# EAGLE design draft1 (EAGLE 9.6.0)
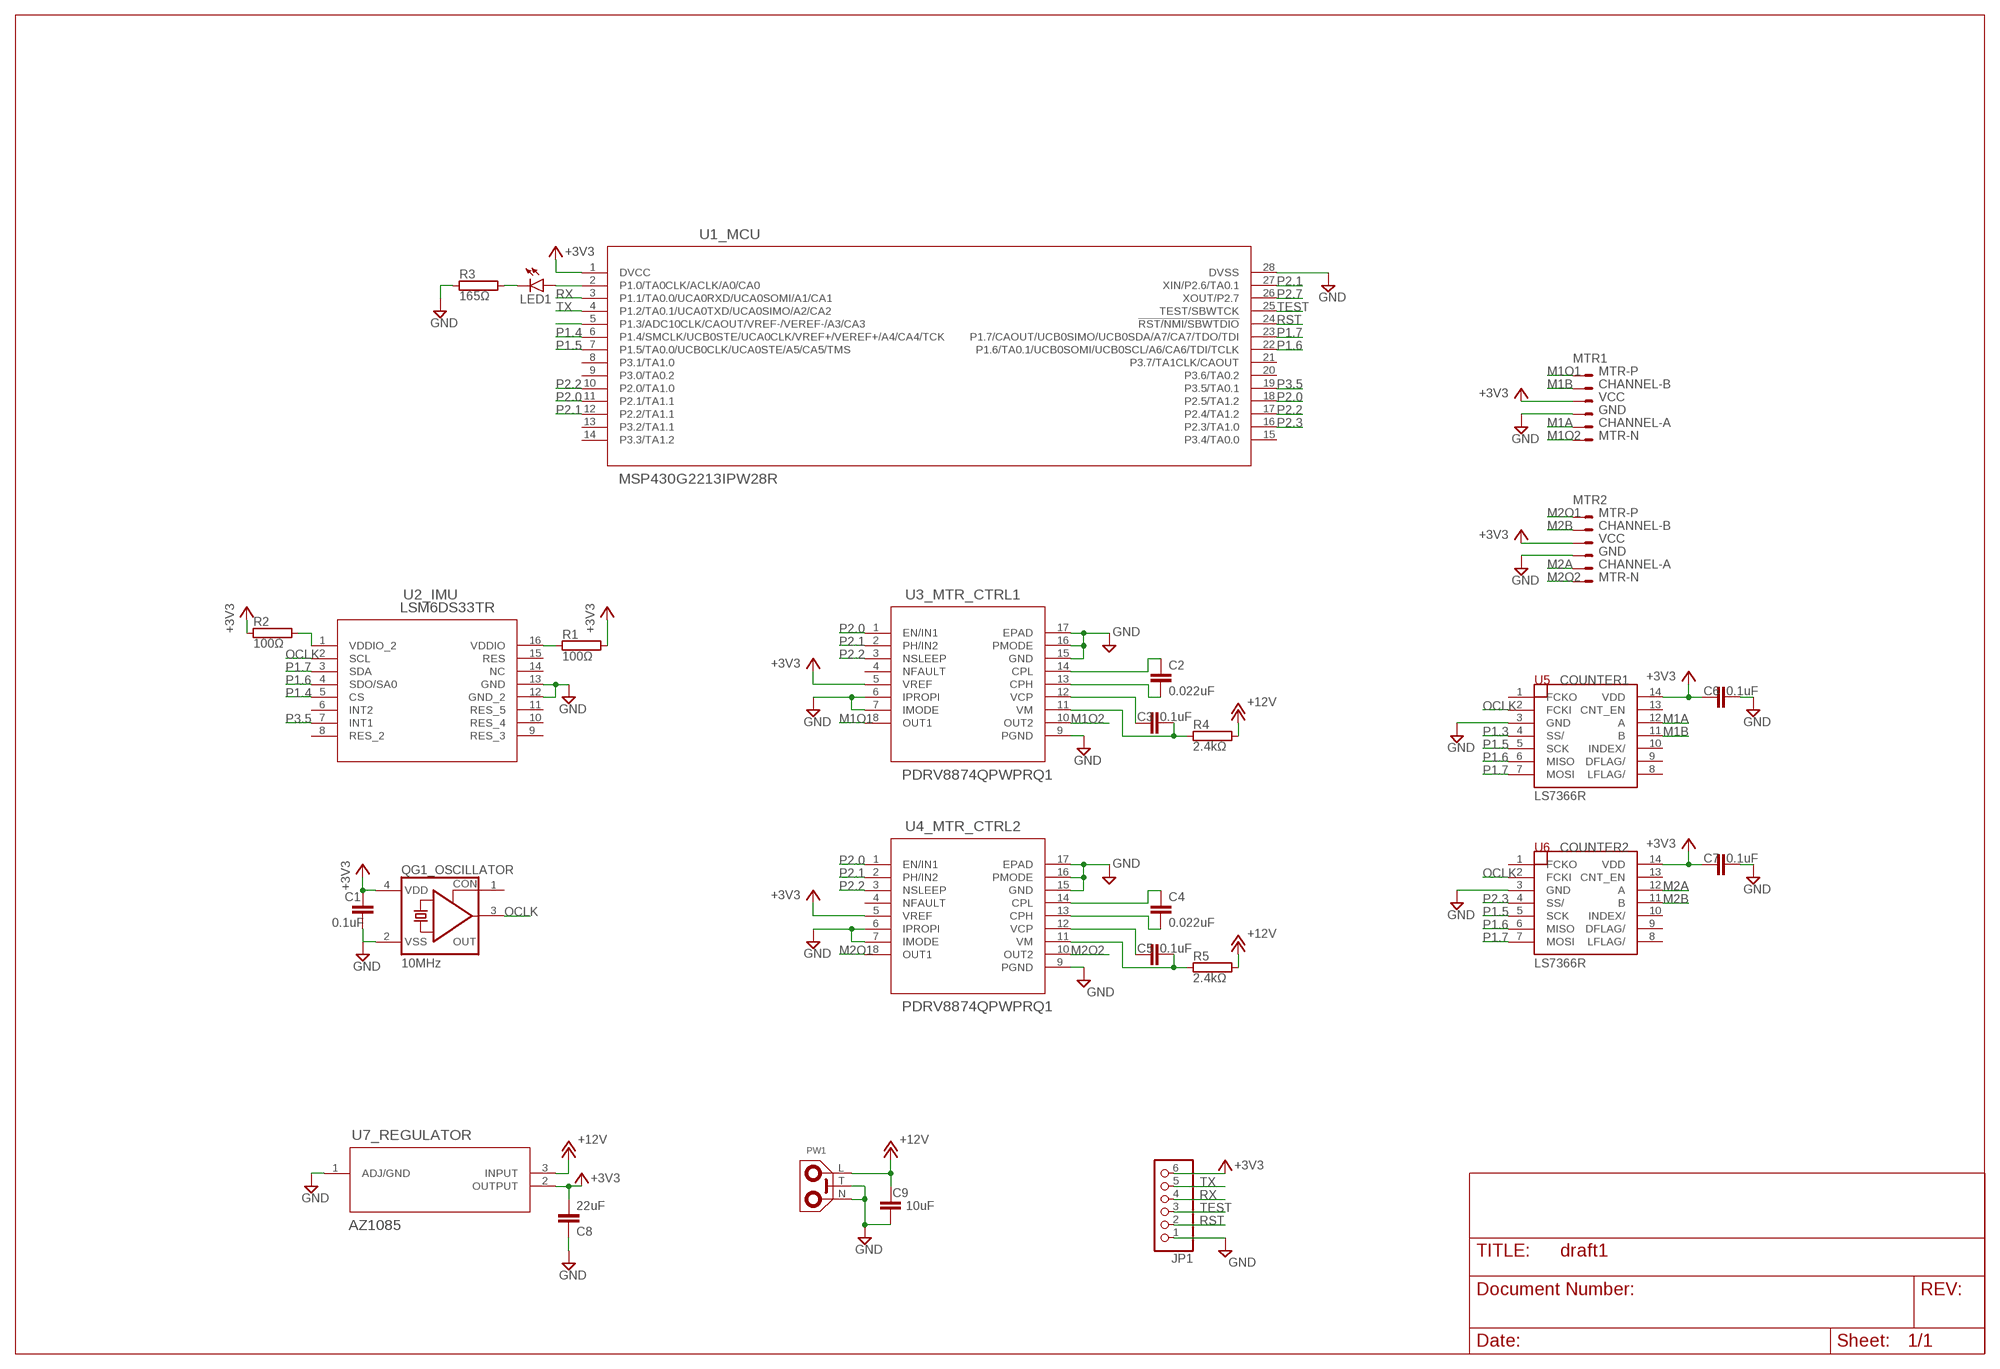
[diagram p0: schematic, sheet 1]

## Parts
C1  0.1uF  C2.5/2  [C2.5-2]
C2  0.022uF  C2.5/2  [C2.5-2]
C3  0.1uF  C2.5/2  [C2.5-2]
C4  0.022uF  C2.5/2  [C2.5-2]
C5  0.1uF  C2.5/2  [C2.5-2]
C6  0.1uF  C2.5/2  [C2.5-2]
C7  0.1uF  C2.5/2  [C2.5-2]
C8  22uF  C2.5/2  [C2.5-2]
C9  10uF  C2.5/2  [C2.5-2]
JP1  PINHD-1X6  [1X06]
LED1  LED5MM  [LED5MM]
MTR1  JST-XH-06-PIN-ROUND-PAD  [JST-XH-06-PACKAGE-ROUND-PAD]
MTR2  JST-XH-06-PIN-ROUND-PAD  [JST-XH-06-PACKAGE-ROUND-PAD]
PW1  POWER-PM  [POWER-PM]
QG1_OSCILLATOR  10MHz  CRYSTAL_RES-1100S  [1100S]
R1  100Ω  RAC01  [AC01]
R2  100Ω  RAC01  [AC01]
R3  165Ω  RAC01  [AC01]
R4  2.4kΩ  RAC01  [AC01]
R5  2.4kΩ  RAC01  [AC01]
U1_MCU  MSP430G2213IPW28R  [PW28]
U2_IMU  LSM6DS33TR  [LGA-16L_3X3]
U3_MTR_CTRL1  PDRV8874QPWPRQ1  [PWP16]
U4_MTR_CTRL2  PDRV8874QPWPRQ1  [PWP16]
U5  LS7366R  [SO14]
U6  LS7366R  [SO14]
U7_REGULATOR  AZ1085  [TO-263_DIO]

## Nets
+3V3: C1.1 C6.1 C7.1 C8.2 JP1.6 MTR1.3 MTR2.3 QG1_OSCILLATOR.4(VDD) R1.2 R2.1 U1_MCU.1(DVCC) U3_MTR_CTRL1.5(VREF) U4_MTR_CTRL2.5(VREF) U5.14(VDD) U6.14(VDD) U7_REGULATOR.2(OUTPUT)
+12V: C9.1 PW1.L R4.2 R5.2 U7_REGULATOR.3(INPUT)
GND: C1.2 C6.2 C7.2 C8.1 C9.2 JP1.1 MTR1.4 MTR2.4 PW1.N PW1.T QG1_OSCILLATOR.2(VSS) R3.1 U1_MCU.28(DVSS) U2_IMU.12(GND_2) U2_IMU.13(GND) U3_MTR_CTRL1.6(IPROPI) U3_MTR_CTRL1.7(IMODE) U3_MTR_CTRL1.9(PGND) U3_MTR_CTRL1.15(GND) U3_MTR_CTRL1.16(PMODE) U3_MTR_CTRL1.17(EPAD) U4_MTR_CTRL2.6(IPROPI) U4_MTR_CTRL2.7(IMODE) U4_MTR_CTRL2.9(PGND) U4_MTR_CTRL2.15(GND) U4_MTR_CTRL2.16(PMODE) U4_MTR_CTRL2.17(EPAD) U5.3(GND) U6.3(GND) U7_REGULATOR.1(ADJ/GND)
M1A: MTR1.5 U5.12(A)
M1B: MTR1.2 U5.11(B)
M1O1: MTR1.1 U3_MTR_CTRL1.8(OUT1)
M1O2: MTR1.6 U3_MTR_CTRL1.10(OUT2)
M2A: MTR2.5 U6.12(A)
M2B: MTR2.2 U6.11(B)
M2O1: MTR2.1 U4_MTR_CTRL2.8(OUT1)
M2O2: MTR2.6 U4_MTR_CTRL2.10(OUT2)
N$1: LED1.A U1_MCU.2(P1.0/TA0CLK/ACLK/A0/CA0)
N$2: R2.2 U2_IMU.1(VDDIO_2)
N$3: R1.1 U2_IMU.16(VDDIO)
N$4: LED1.K(C) R3.2
N$5: U1_MCU.5(P1.3/ADC10CLK/CAOUT/VREF-/VEREF-/A3/CA3)
N$6: C2.1 U3_MTR_CTRL1.14(CPL)
N$7: C2.2 U3_MTR_CTRL1.13(CPH)
N$8: C3.1 U3_MTR_CTRL1.12(VCP)
N$9: C4.1 U4_MTR_CTRL2.14(CPL)
N$10: C3.2 R4.1 U3_MTR_CTRL1.11(VM)
N$12: C4.2 U4_MTR_CTRL2.13(CPH)
N$13: C5.1 U4_MTR_CTRL2.12(VCP)
N$14: C5.2 R5.1 U4_MTR_CTRL2.11(VM)
OCLK: QG1_OSCILLATOR.3(OUT) U2_IMU.2(SCL) U5.2(FCKI) U6.2(FCKI)
P1.3: U5.4(SS/)
P1.4: U1_MCU.6(P1.4/SMCLK/UCB0STE/UCA0CLK/VREF+/VEREF+/A4/CA4/TCK) U2_IMU.5(CS)
P1.5: U1_MCU.7(P1.5/TA0.0/UCB0CLK/UCA0STE/A5/CA5/TMS) U5.5(SCK) U6.5(SCK)
P1.6: U1_MCU.22(P1.6/TA0.1/UCB0SOMI/UCB0SCL/A6/CA6/TDI/TCLK) U2_IMU.4(SDO/SA0) U5.6(MISO) U6.6(MISO)
P1.7: U1_MCU.23(P1.7/CAOUT/UCB0SIMO/UCB0SDA/A7/CA7/TDO/TDI) U2_IMU.3(SDA) U5.7(MOSI) U6.7(MOSI)
P2.0: U1_MCU.11(P2.1/TA1.1) U1_MCU.18(P2.5/TA1.2) U3_MTR_CTRL1.1(EN/IN1) U4_MTR_CTRL2.1(EN/IN1)
P2.1: U1_MCU.12(P2.2/TA1.1) U1_MCU.27(XIN/P2.6/TA0.1) U3_MTR_CTRL1.2(PH/IN2) U4_MTR_CTRL2.2(PH/IN2)
P2.2: U1_MCU.10(P2.0/TA1.0) U1_MCU.17(P2.4/TA1.2) U3_MTR_CTRL1.3(NSLEEP) U4_MTR_CTRL2.3(NSLEEP)
P2.3: U1_MCU.16(P2.3/TA1.0) U6.4(SS/)
P2.7: U1_MCU.26(XOUT/P2.7)
P3.5: U1_MCU.19(P3.5/TA0.1) U2_IMU.7(INT1)
RST: JP1.2 U1_MCU.24(!RST/NMI/SBWTDIO)
RX: JP1.4 U1_MCU.3(P1.1/TA0.0/UCA0RXD/UCA0SOMI/A1/CA1)
TEST: JP1.3 U1_MCU.25(TEST/SBWTCK)
TX: JP1.5 U1_MCU.4(P1.2/TA0.1/UCA0TXD/UCA0SIMO/A2/CA2)
Unconnected: QG1_OSCILLATOR.1(CON) U1_MCU.8(P3.1/TA1.0) U1_MCU.9(P3.0/TA0.2) U1_MCU.13(P3.2/TA1.1) U1_MCU.14(P3.3/TA1.2) U1_MCU.15(P3.4/TA0.0) U1_MCU.20(P3.6/TA0.2) U1_MCU.21(P3.7/TA1CLK/CAOUT) U2_IMU.6(INT2) U2_IMU.8(RES_2) U2_IMU.9(RES_3) U2_IMU.10(RES_4) U2_IMU.11(RES_5) U2_IMU.14(NC) U2_IMU.15(RES) U3_MTR_CTRL1.4(NFAULT) U4_MTR_CTRL2.4(NFAULT) U5.1(FCKO) U5.8(LFLAG/) U5.9(DFLAG/) U5.10(INDEX/) U5.13(CNT_EN) U6.1(FCKO) U6.8(LFLAG/) U6.9(DFLAG/) U6.10(INDEX/) U6.13(CNT_EN)

## Library data of the parts
C1-C9 = capacitor-wima:C: CAPACITOR naming: grid - package width
JP1 = pinhead:PINHD-1X6: PIN HEADER
LED1 = led:LED: LED OSRAM: - CHIPLED LG R971, LG N971, LY N971, LG Q971, LY Q971, LO R971, LY R971 LH N974, LH R974 LS Q976, LO Q976, LY Q976 LO Q996 - Hyper CHIPLED LW Q18S LB Q993, LB Q99A, LB R99A - SideLED LS A670, LO A670, LY A670, LG A670, LP A670 LB A673, LV A673, LT A673, LW A673 LH A674 LY A675 LS A676, LA A676, LO A676, LY A676, LW A676 LS A679, LY A679, LG A679 - Hyper Micro SIDELED® LS Y876, LA Y876, LO Y876, LY Y876 LT Y87S - SmartLED LW L88C, LW L88S LB L89C, LB L89S, LG L890 LS L89K, LO L89K, LY L89K LS L896, LA L896, LO L896, LY L896 - TOPLED LS T670, LO T670, LY T670, LG T670, LP T670 LSG T670, LSP T670, LSY T670, LOP T670, LYG T670 LG T671, LOG T671, LSG T671 LB T673, LV T673, LT T673, LW T673 LH T674 LS T676, LA T676, LO T676, LY T676, LB T676, LH T676, LSB T676, LW T676 LB T67C, LV T67C, LT T67C, LS T67K, LO T67K, LY T67K, LW E67C LS E67B, LA E67B, LO E67B, LY E67B, LB E67C, LV E67C, LT E67C LW T67C LS T679, LY T679, LG T679 LS T770, LO T770, LY T770, LG T770, LP T770 LB T773, LV T773, LT T773, LW T773 LH T774 LS E675, LA E675, LY E675, LS T675 LS T776, LA T776, LO T776, LY T776, LB T776 LHGB T686 LT T68C, LB T68C - Hyper Mini TOPLED® LB M676 - Mini TOPLED Santana® LG M470 LS M47K, LO M47K, LY M47K Source: http://www.osram.convergy.de LUXEON: - LUMILED® LXK2-PW12-R00, LXK2-PW12-S00, LXK2-PW14-U00, LXK2-PW14-V00 LXK2-PM12-R00, LXK2-PM12-S00, LXK2-PM14-U00 LXK2-PE12-Q00, LXK2-PE12-R00, LXK2-PE12-S00, LXK2-PE14-T00, LXK2-PE14-U00 LXK2-PB12-K00, LXK2-PB12-L00, LXK2-PB12-M00, LXK2-PB14-N00, LXK2-PB14-P00, LXK2-PB14-Q00 LXK2-PR12-L00, LXK2-PR12-M00, LXK2-PR14-Q00, LXK2-PR14-R00 LXK2-PD12-Q00, LXK2-PD12-R00, LXK2-PD12-S00 LXK2-PH12-R00, LXK2-PH12-S00 LXK2-PL12-P00, LXK2-PL12-Q00, LXK2-PL12-R00 Source: www.luxeon.com KINGBRIGHT: KA-3528ASYC Source: www.kingbright.com
MTR1 MTR2 = JST:JST-XH-06-PIN: JST XH Connector 2 Pin Wire to board connector. Pitch: 2,54 mm, (0.100") Number of pins: 6 Created by Rembrandt Electronics www.rembrandtelectronics.com; MTR1: 1
PW1 = Power-in:POWER-PM
QG1_OSCILLATOR = SE423EagleLibrary:CRYSTAL_RES-: CRYSTAL RESONATOR; OC_FARNELL: unknown; OC_NEWARK: unknown
R1-R5 = resistor-power:R: Power Resitor; OC_FARNELL: unknown; OC_NEWARK: unknown
U1_MCU = SE423EagleLibrary:MSP430G2213IPW28R; BUILT_BY: EMA_UL_Team; MANUFACTURER: Texas Instruments; MANUFACTURER_PART_NUMBER: MSP430G2213IPW28R; VENDOR: Texas Instruments
U2_IMU = SE423EagleLibrary:LSM6DS33TR; BUILT_BY: EMA_Jessica; COPYRIGHT: Copyright (C) 2018 Accelerated Designs. All rights reserved; MANUFACTURER_PART_NUMBER: LSM6DS33TR; VENDOR: STMicroelectronics
U3_MTR_CTRL1 U4_MTR_CTRL2 = SE423EagleLibrary:PDRV8874QPWPRQ1; COPYRIGHT: Copyright (C) 2018 Accelerated Designs. All rights reserved; MANUFACTURER_PART_NUMBER: PDRV8874QPWPRQ1; VENDOR: Texas Instruments
U5 U6 = SE423EagleLibrary:LS7366R
U7_REGULATOR = Power-in:AZ1085; BUILT_BY: EMA_UL_Team; MANUFACTURER_PART_NUMBER: AZ1085CS-2.5TRE1; SOURCELIBRARY: DIODESINC_2_2015-08-18; VENDOR: Diodes Inc

## Board
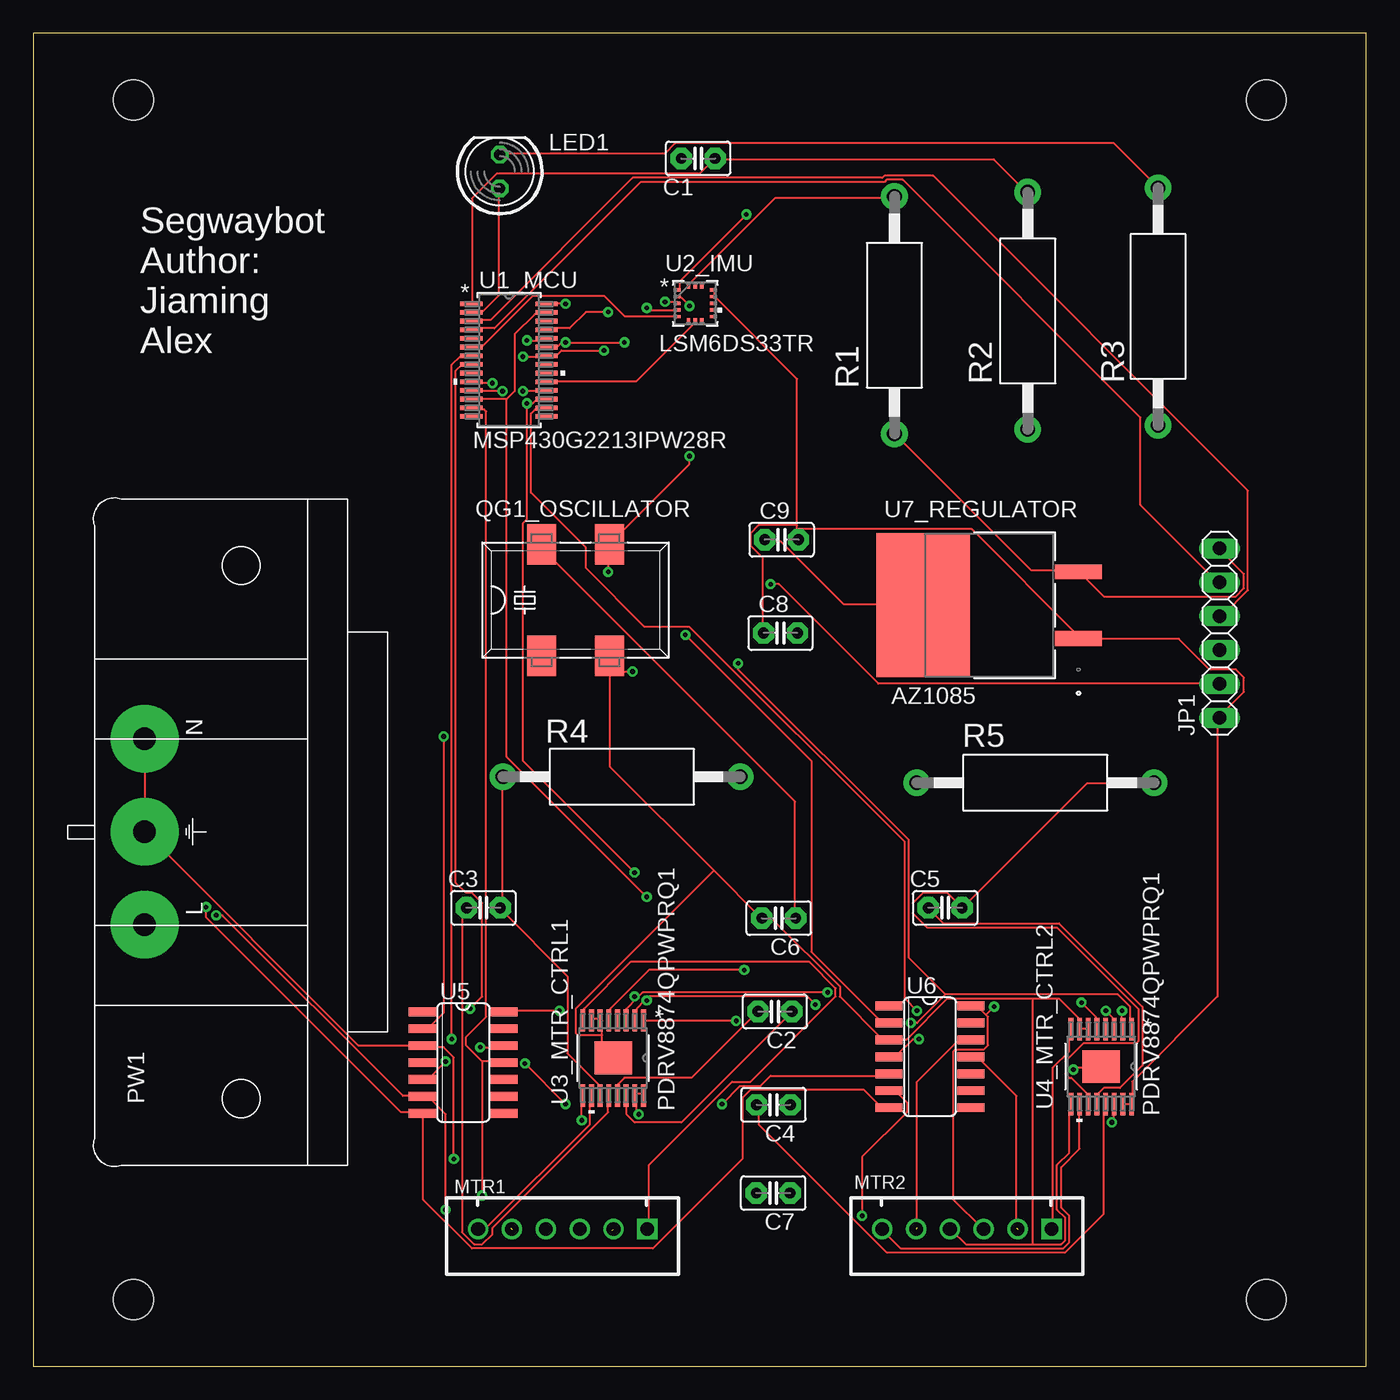
[diagram p1: board, top side]
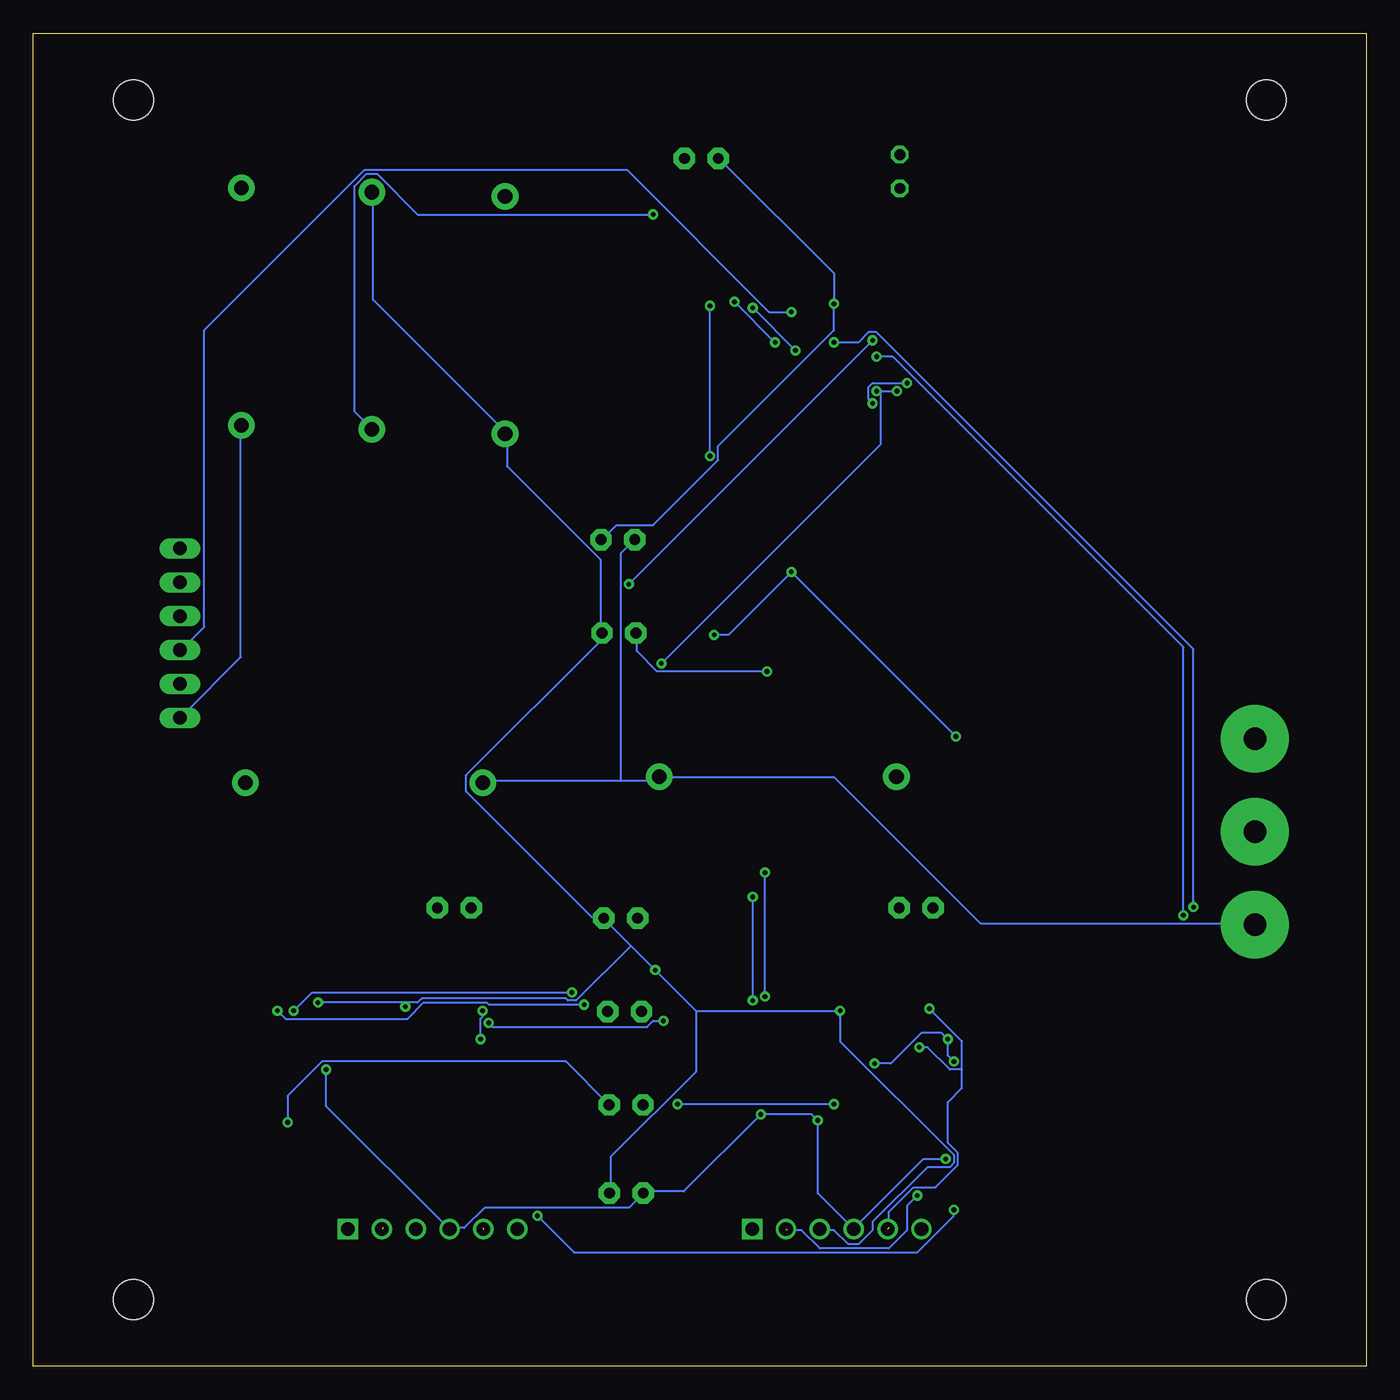
[diagram p2: board, bottom side, seen from below]

Size 100 x 100 mm. Coordinates in mm from the lower left corner, seen from the top.
Outline: 0,0 100,0 100,100 0,100 0,0
Copper layers (1*16): Top 0.035mm / dielectric 1.5mm / Bottom 0.035mm
Design rules "default": minimum track width 6mil, minimum drill 0.35mm, track to track 6mil, track to pad 6mil, pad to pad 6mil, via to via 6mil, smd to smd 6mil, copper to edge 40mil, drill to drill 6mil, minimum pad ring 10mil, minimum via ring 8mil, stop-mask expansion 4mil, vias tented up to drill 0mil, thermal gap 10mil
Holes 3 mm at 7.5,5 7.5,95 92.5,95 92.5,5

### Footprints (pad centres in the part's own frame; a part is rotated, then mirrored left to right if it is on the bottom)
C2.5-2 = drill 0.813 pad 1.6 octagon: 1 -1.27,0; 2 1.27,0
1X06 = drill 1.016 long: 1 -6.35,0; 2 -3.81,0; 3 -1.27,0; 4 1.27,0; 5 3.81,0; 6 6.35,0
LED5MM = drill 0.813 octagon: A -1.27,0; K 1.27,0
JST-XH-06-PACKAGE-ROUND-PAD = drill 1.016 square: 1 -6.35,0 | drill 1.016: 2 -3.81,0; 3 -1.27,0; 4 1.27,0; 5 3.81,0; 6 6.35,0
POWER-PM = drill 1.676 pad 5.08: L 6.985,-6.35; N -6.985,-6.35; T 0,-6.35
1100S = smd 2.184 x 3.048: 1 -2.54,-4.191; 2 2.54,-4.191; 3 2.54,4.191; 4 -2.54,4.191
AC01 = drill 1.1 pad 2: 1 -8.9,0; 2 8.9,0
PW28 = smd 1.676 x 0.356: 1 -2.819,4.225; 2 -2.819,3.575; 3 -2.819,2.925; 4 -2.819,2.275; 5 -2.819,1.625; 6 -2.819,0.975; 7 -2.819,0.325; 8 -2.819,-0.325; 9 -2.819,-0.975; 10 -2.819,-1.625; 11 -2.819,-2.275; 12 -2.819,-2.925; 13 -2.819,-3.575; 14 -2.819,-4.225; 15 2.819,-4.225; 16 2.819,-3.575; 17 2.819,-2.925; 18 2.819,-2.275; 19 2.819,-1.625; 20 2.819,-0.975; 21 2.819,-0.325; 22 2.819,0.325; 23 2.819,0.975; 24 2.819,1.625; 25 2.819,2.275; 26 2.819,2.925; 27 2.819,3.575; 28 2.819,4.225
LGA-16L_3X3 = smd 0.356 x 0.254: 1 -1.27,1; 2 -1.27,0.5; 3 -1.27,0; 4 -1.27,-0.5; 5 -1.27,-1; 9 1.27,-1; 10 1.27,-0.5; 11 1.27,0; 12 1.27,0.5; 13 1.27,1 | smd 0.254 x 0.356: 6 -0.5,-1.27; 7 0,-1.27; 8 0.5,-1.27; 14 0.5,1.27; 15 0,1.27; 16 -0.5,1.27
PWP16 = smd 1.676 x 0.356: 1 -2.819,2.275; 2 -2.819,1.625; 3 -2.819,0.975; 4 -2.819,0.325; 5 -2.819,-0.325; 6 -2.819,-0.975; 7 -2.819,-1.625; 8 -2.819,-2.275; 9 2.819,-2.275; 10 2.819,-1.625; 11 2.819,-0.975; 12 2.819,-0.325; 13 2.819,0.325; 14 2.819,0.975; 15 2.819,1.625; 16 2.819,2.275 | smd 2.464 x 2.819: 17 0,0
SO14 = smd 0.66 x 2.032: 1 -3.81,-3.073; 2 -2.54,-3.073; 3 -1.27,-3.073; 4 0,-3.073; 5 1.27,-3.073; 6 2.54,-3.073; 7 3.81,-3.073; 8 3.81,3.073; 9 2.54,3.073; 10 1.27,3.073; 11 0,3.073; 12 -1.27,3.073; 13 -2.54,3.073; 14 -3.81,3.073
TO-263_DIO = smd 1.1 x 3.5: 1 -2.5,-6.7; 2 2.5,-6.7 | smd 10.8 x 7.01: 3 0,4.945

### Placement (x,y rotation side)
C1  49.88,90.61 180 top
C2  55.64,26.61 180 top
C3  33.77,34.39 0 top
C4  55.53,19.61 180 top
C5  68.42,34.39 0 top
C6  55.93,33.61 180 top
C7  55.51,12.99 180 top
C8  56.06,55.01 0 top
C9  56.14,62.01 0 top
JP1  89,55 90 top
LED1  34.99,89.63 90 top
MTR1  39.72,10.28 180 top
MTR2  70.04,10.28 180 top
PW1  14.7,40.1 270 top
QG1_OSCILLATOR  40.68,57.48 0 top
R1  64.61,78.86 270 top
R2  74.61,79.18 270 top
R3  84.39,79.5 90 top
R4  44.14,44.23 0 top
R5  75.18,43.77 180 top
U1_MCU  35.69,75.48 0 top
U2_IMU  49.66,79.74 0 top
U3_MTR_CTRL1  43.5,23.12 270 top
U4_MTR_CTRL2  80.12,22.48 270 top
U5  32.26,22.78 270 top
U6  67.26,23.21 270 top
U7_REGULATOR  71.71,57.09 90 top

### Tracks (layer width: path | path; a pad name or v marks a point on that pad's centre or on a via)
+3V3  (via drill 0.35)
  Top 0.152: U1_MCU.1 32.92,79.7 32.92,87.63 34.75,89.46 49.99,89.46 51.05,90.53 C1.1 51.21,90.53 72.08,90.53 74.52,88.09 R2.1 | JP1.6 89,61.27 90.83,59.44 90.83,58.37 90.22,57.76 80.31,57.76 78.49,59.59 U7_REGULATOR.2 78.33,59.74 74.83,59.74 R1.2 | 71.48,26.36 71.63,26.21 71.63,24.08 71.32,23.77 69.19,23.77 69.04,23.62 69.04,12.5 71.17,10.36 MTR2.3 | 71.48,26.36 70.87,26.98 70.41,26.98 U6.14 | v53.34,29.72 46.18,29.72 43.28,26.82 43.28,26.06 U3_MTR_CTRL1.5 | v78.64,27.28 79.7,26.21 79.7,25.45 U4_MTR_CTRL2.5 | v39.47,26.67 35.36,26.67 U5.14 | QG1_OSCILLATOR.4 38.25,61.57 38.25,61.27 57.15,42.37 57.15,33.68 C6.1 | v72.08,26.98 71.48,26.36
  Bottom 0.152: R2.1 74.52,87.94 74.52,80.01 64.62,70.1 R1.2 64.47,69.95 64.47,67.51 57.45,60.5 57.45,55.02 C8.2 57.45,54.86 57.45,54.41 67.51,44.35 67.51,43.13 58.06,33.68 57.3,33.68 C6.1 57.15,33.53 55.17,31.55 | 55.17,31.55 v53.34,29.72 50.29,26.67 | 72.08,27.28 71.17,27.28 70.87,27.58 60.05,27.58 59.89,27.43 59.28,27.43 55.17,31.55 | 72.08,27.28 v78.64,27.28 | 50.29,26.67 v39.47,26.67 39.47,24.38 30.94,15.85 30.94,15.24 31.24,14.94 32.92,14.94 37.03,10.82 37.03,10.21 38.1,9.14 38.86,9.14 39.93,10.21 40.84,10.21 MTR1.3 | 50.29,26.67 50.29,22.1 56.69,15.7 56.69,13.11 C7.1 | 72.08,27.28 v72.08,26.98
+12V
  Top 0.152: C9.1 55.02,61.87 56.08,61.87 60.81,57.15 66.75,57.15 U7_REGULATOR.3
  Bottom 0.152: 55.93,43.89 53.49,43.89 53.19,44.2 R4.2 53.03,44.2 39.93,44.2 28.96,33.22 8.38,33.22 PW1.L | 55.93,43.89 66.14,43.89 R5.2 | 55.93,43.89 55.93,60.96 55.02,61.87 C9.1
GND  (via drill 0.35)
  Top 0.152: v39.93,79.7 38.56,79.7 U1_MCU.28 | U2_IMU.13 51.05,80.62 51.05,80.31 U2_IMU.12 51.05,80.16 51.21,80.16 57.3,74.07 57.3,63.09 | 57.3,62.79 57.3,62.03 C9.2 57.3,62.79 | 57.3,62.79 57.3,63.09 | 57.3,63.09 54.41,63.09 53.8,62.48 53.8,61.57 54.71,60.66 54.71,55.02 C8.1 | U4_MTR_CTRL2.15 81.84,19.66 82.3,19.66 U4_MTR_CTRL2.16 82.45,19.81 82.45,21.34 88.85,27.74 88.85,48.62 JP1.1 89,48.77 90.83,50.6 90.83,51.66 90.22,52.27 88.24,52.27 85.95,54.56 78.49,54.56 U7_REGULATOR.1 78.49,54.71 70.41,62.79 57.3,62.79 | U4_MTR_CTRL2.6 79.1,25.3 78.64,25.3 U4_MTR_CTRL2.7 78.49,25.45 78.49,26.06 76.96,27.58 74.98,27.58 | 74.98,27.58 68.58,27.58 65.53,24.54 64.31,24.54 U6.3 64.16,24.54 63.7,24.54 60.5,27.74 60.5,28.5 55.47,33.53 54.71,33.53 C6.2 54.56,33.68 51.05,37.19 | U3_MTR_CTRL1.7 41.91,26.06 42.52,26.06 U3_MTR_CTRL1.6 42.67,25.91 42.67,24.84 | 42.67,24.84 42.67,23.93 43.43,23.16 U3_MTR_CTRL1.17 | 43.28,52.12 43.28,44.96 51.05,37.19 | 43.28,52.12 43.28,53.19 QG1_OSCILLATOR.2 43.28,52.12 | 42.67,24.84 40.84,24.84 40.69,24.99 40.69,26.82 51.05,37.19 | PW1.N 8.38,46.94 8.38,40.23 PW1.T 8.38,40.08 24.38,24.08 29.11,24.08 U5.3 29.26,23.93 30.79,23.93 31.55,23.16 v31.55,15.54 | 74.98,9.14 69.95,9.14 68.89,10.21 MTR2.4 | 74.98,9.14 77.11,9.14 77.42,9.45 77.42,11.12 76.81,11.73 76.81,15.09 77.72,16 77.72,19.66 U4_MTR_CTRL2.9 | v78.03,22.25 78.18,22.4 80.01,22.4 U4_MTR_CTRL2.17 | U3_MTR_CTRL1.16 45.72,20.42 45.26,20.42 U3_MTR_CTRL1.15 45.26,20.27 45.26,19.05 v45.41,18.9 | v41.15,18.44 41.15,20.27 U3_MTR_CTRL1.9 | 74.98,9.14 74.98,27.58 | 43.28,52.12 v44.96,52.12
  Bottom 0.152: C1.2 48.46,90.53 39.93,81.99 v39.93,79.7 39.93,77.72 48.62,69.04 48.62,67.97 53.49,63.09 56.24,63.09 57.3,62.03 C9.2 | R3.1 84.43,70.56 84.43,53.19 88.85,48.77 JP1.1 | v78.03,22.25 78.03,19.51 68.89,10.36 MTR2.4 68.73,10.36 67.67,10.36 66.14,11.89 55.32,11.89 54.25,12.95 C7.2 54.1,13.11 51.21,13.11 v45.41,18.9 41.6,18.9 v41.15,18.44 41.15,12.95 38.56,10.36 MTR1.4 38.41,10.36 33.22,15.54 v31.55,15.54 | v44.96,52.12 53.19,52.12 54.71,53.65 54.71,54.86 C8.1
M1A  (via drill 0.35)  (1 unrouted)
  Top 0.152: 32.77,75.13 32.16,75.13 31.7,74.68 31.7,36.27 32.46,35.51 32.92,35.51 33.68,34.75 33.68,27.74 v32.77,26.82 | v33.53,23.93 35.2,23.93 U5.12
  Bottom 0.152: v32.77,26.82 30.33,24.38 30.33,22.25 | 30.33,22.25 30.33,20.88 31.39,19.81 31.39,16.76 30.63,16 30.63,15.09 32.31,13.41 33.98,13.41 35.81,11.58 35.81,10.36 | v33.53,23.93 32.92,23.93 31.24,22.25 30.33,22.25
M1B  (via drill 0.35)  (1 unrouted)
  Top 0.152: 32.92,71.78 33.83,71.78 33.98,71.63 33.98,26.21 32.46,24.69 32.46,24.08 33.68,22.86 | 33.68,22.86 35.2,22.86 U5.11 | 33.68,22.86 v33.68,12.8
  Bottom 0.152: 43.43,10.21 42.37,10.21 41,8.84 35.81,8.84 34.44,10.21 34.44,12.04 v33.68,12.8
M1O1
  Top 0.152: U3_MTR_CTRL1.8 41.3,26.06 41.3,26.82 44.81,30.33 58.22,30.33 60.2,28.35 60.2,27.74 53.8,21.34 52.43,21.34 46.18,15.09 46.18,10.36 MTR1.1
M1O2
  Top 0.152: U3_MTR_CTRL1.10 41.76,20.27 41.76,18.14 33.98,10.36 33.38,10.36 MTR1.6
M2A  (1 unrouted)
  Top 0.152: 66.29,10.36 66.29,21.34 69.34,24.38 70.26,24.38 U6.12
M2B  (1 unrouted)
  Top 0.152: 73.76,10.36 73.76,20.27 70.87,23.16 70.41,23.16 U6.11
M2O1
  Top 0.152: U4_MTR_CTRL2.8 77.72,25.3 77.72,23.62 76.5,22.4 76.5,10.36 MTR2.1
M2O2
  Top 0.152: U4_MTR_CTRL2.10 78.49,19.66 78.49,16.31 77.11,14.94 77.11,11.89 77.72,11.28 77.72,9.3 77.27,8.84 65.08,8.84 63.7,10.21 MTR2.6
N$1
  Top 0.152: U1_MCU.2 32.92,79.1 33.68,79.1 34.9,80.31 34.9,88.24 LED1.A
N$2  (via drill 0.35)
  Top 0.152: v53.49,86.41 48.46,81.38 48.46,80.77 U2_IMU.1
  Bottom 0.152: v53.49,86.41 71.17,86.41 74.22,89.46 74.98,89.46 75.89,88.54 75.89,71.63 74.68,70.41 R2.2
N$3
  Top 0.152: U2_IMU.16 49.23,81.08 49.23,81.23 55.63,87.63 64.47,87.63 R1.1
N$4
  Top 0.152: LED1.K 35.05,90.98 47.4,90.98 48.16,91.75 81.08,91.75 84.28,88.54 R3.2
N$6
  Top 0.152: U3_MTR_CTRL1.14 44.5,20.27 44.5,18.9 45.11,18.29 48.62,18.29 56.84,26.52 C2.1
N$7
  Top 0.152: U3_MTR_CTRL1.13 43.89,20.42 43.89,21.18 44.35,21.64 49.38,21.64 54.25,26.52 C2.2
N$8
  Top 0.152: U3_MTR_CTRL1.12 43.13,20.27 43.13,19.05 34.44,10.36 34.44,9.91 33.68,9.14 33.07,9.14 32.16,10.06 32.16,33.98 32.46,34.29 C3.1
N$9  (via drill 0.35)
  Top 0.152: v80.92,18.29 81.08,18.44 81.08,19.66 U4_MTR_CTRL2.14
  Bottom 0.152: v80.92,18.29 80.92,20.27 78.33,22.86 60.05,22.86 56.84,19.66 C4.1
N$10
  Top 0.152: U3_MTR_CTRL1.11 42.52,20.42 42.52,21.03 40.08,23.47 40.08,29.26 35.05,34.29 C3.2 35.05,34.44 35.2,34.59 35.2,44.2 R4.1
N$12
  Top 0.152: U4_MTR_CTRL2.13 80.31,19.66 80.31,11.43 77.42,8.53 64.01,8.53 54.41,18.14 54.41,19.51 C4.2
N$13
  Top 0.152: U4_MTR_CTRL2.12 79.86,19.81 79.86,20.42 80.31,20.88 81.53,20.88 83.21,22.55 83.21,26.98 76.96,33.22 68.28,33.22 67.21,34.29 C5.1
N$14
  Top 0.152: U4_MTR_CTRL2.11 79.1,19.81 79.1,20.42 77.88,21.64 77.72,21.64 77.42,21.95 77.42,22.86 78.79,24.23 82.75,24.23 82.91,24.38 82.91,26.82 76.81,32.92 67.06,32.92 65.99,33.98 65.99,34.75 66.75,35.51 68.58,35.51 69.65,34.44 C5.2 69.8,34.44 79.1,43.74 83.97,43.74 R5.1
OCLK  (via drill 0.35)
  Top 0.152: v49.23,79.55 48.62,80.16 48.46,80.16 U2_IMU.2 | v49.23,68.28 49.23,67.67 43.28,61.72 QG1_OSCILLATOR.3 43.13,61.57 v43.13,59.59 | v30.79,47.24 30.79,26.52 29.72,25.45 29.26,25.45 U5.2 | v48.92,54.86 58.37,45.41 58.37,31.09 63.7,25.76 64.16,25.76 U6.2
  Bottom 0.152: v49.23,68.28 v49.23,79.55 | v30.79,47.24 v43.13,59.59 47.85,54.86 v48.92,54.86
P1.4
  Top 0.152: U2_IMU.5 48.31,78.79 44.35,78.79 42.82,80.31 37.49,80.31 33.68,76.5 32.92,76.5 U1_MCU.6
P1.5  (via drill 0.35)
  Top 0.152: v31.39,24.54 31.39,75.13 32,75.74 32.77,75.74 U1_MCU.7 | v30.94,22.86 29.72,21.64 29.26,21.64 U5.5 | v51.66,19.66 53.03,21.03 54.56,21.03 55.32,21.79 64.16,21.79 U6.5 | v36.88,22.71 v39.93,19.66
  Bottom 0.152: v30.94,22.86 31.39,23.32 v31.39,24.54 31.85,24.99 33.38,24.99 35.66,22.71 v36.88,22.71 | v39.93,19.66 v51.66,19.66
P1.6  (via drill 0.35)
  Top 0.152: v46.02,79.4 46.18,79.25 48.31,79.25 U2_IMU.4 | v42.82,76.2 39.62,76.2 39.32,75.89 38.56,75.89 U1_MCU.22 38.41,75.74 v36.73,75.74 | v30.94,11.73 30.94,18.9 29.72,20.12 29.26,20.12 U5.6 29.11,20.27 27.74,20.27 14.17,33.83 v13.72,33.83 | v62.18,11.28 62.18,15.7 65.53,19.05 65.53,19.81 64.77,20.57 64.31,20.57 U6.6
  Bottom 0.152: v42.82,76.2 v46.02,79.4 | v30.94,11.73 30.94,11.28 33.68,8.53 59.44,8.53 v62.18,11.28 | v36.73,75.74 35.51,75.74 13.72,53.95 v13.72,33.83
P1.7  (via drill 0.35)
  Top 0.152: v47.4,79.86 48.31,79.86 U2_IMU.3 | v44.35,76.81 v39.93,76.81 39.62,76.81 39.32,76.5 38.56,76.5 U1_MCU.23 | U6.7 64.16,19.51 63.55,19.51 62.33,20.73 53.8,20.73 53.19,20.12 53.19,15.54 46.48,8.84 32.92,8.84 29.26,12.5 29.26,18.9 U5.7 29.11,19.05 27.58,19.05 12.95,33.68 v12.95,34.44
  Bottom 0.152: v44.35,76.81 v47.4,79.86 | v39.93,76.81 38.1,76.81 37.34,77.57 36.73,77.57 12.95,53.8 v12.95,34.44
P2.0  (via drill 0.35)
  Top 0.152: v35.2,73.15 32.92,73.15 U1_MCU.11 | v36.73,73.15 38.41,73.15 U1_MCU.18 | v52.73,25.91 45.87,25.91 U3_MTR_CTRL1.1 | v65.84,25.76 66.29,25.76 68.43,27.89 | 68.43,27.89 81.38,27.89 82.3,26.98 82.3,25.45 U4_MTR_CTRL2.1 | v52.88,52.73 52.88,52.27 65.68,39.47 65.68,30.63 68.43,27.89
  Bottom 0.152: 36.42,73.15 v35.2,73.15 | v52.73,25.91 53.49,25.91 53.95,25.45 65.53,25.45 v65.84,25.76 | 36.42,73.15 36.42,69.19 v52.88,52.73 | 36.42,73.15 v36.73,73.15
P2.1  (via drill 0.35)
  Top 0.152: 35.51,72.54 32.92,72.54 U1_MCU.12 | 35.51,72.54 36.12,73.15 36.12,77.42 37.64,78.94 38.41,78.94 U1_MCU.27 | 45.87,27.43 46.18,27.74 58.06,27.74 v58.67,27.13 | 45.87,27.43 45.26,26.82 45.26,26.06 U3_MTR_CTRL1.2 | v81.69,26.67 81.69,25.45 U4_MTR_CTRL2.2 | 35.51,72.54 35.51,45.72 v46.02,35.2 | 45.87,27.43 v46.02,27.43
  Bottom 0.152: v58.67,27.13 65.84,27.13 65.99,27.28 70.71,27.28 71.93,26.06 81.08,26.06 v81.69,26.67 | v46.02,27.43 v46.02,35.2
P2.2  (via drill 0.35)
  Top 0.152: v34.44,73.76 32.92,73.76 U1_MCU.10 | U1_MCU.17 38.41,72.54 37.8,72.54 37.49,72.24 v37.03,72.24 37.03,63.55 36.73,63.25 36.73,45.41 v45.11,37.03 | 45.26,27.58 45.72,28.04 v59.59,28.04 | 45.26,27.58 44.5,26.82 44.5,26.06 U3_MTR_CTRL1.3 | v80.47,26.67 81.08,26.06 81.08,25.45 U4_MTR_CTRL2.3 | 45.26,27.58 v45.11,27.74
  Bottom 0.152: v34.44,73.76 37.03,73.76 37.34,73.46 37.34,72.54 v37.03,72.24 | v59.59,28.04 79.1,28.04 v80.47,26.67 | v45.11,27.74 v45.11,37.03
P2.3  (via drill 0.35)
  Top 0.152: v66.29,26.67 65.38,27.58 65.38,39.32 49.23,55.47 45.87,55.47 41.45,59.89 41.45,61.42 37.34,65.53 37.34,71.48 37.64,71.78 38.41,71.78 U1_MCU.16 | v66.45,24.54 65.99,24.54 64.77,23.32 64.31,23.32 U6.4
  Bottom 0.152: v66.29,26.67 66.29,26.21 66.45,26.06 v66.45,24.54
P3.5
  Top 0.152: U2_IMU.7 49.68,78.33 45.26,73.91 38.56,73.91 U1_MCU.19
RST  (via drill 0.35)
  Top 0.152: v37.03,76.96 38.41,76.96 U1_MCU.24 | v55.32,58.67 55.93,58.67 63.4,51.21 88.85,51.21 JP1.2
  Bottom 0.152: v55.32,58.67 v37.03,76.96
RX
  Top 0.152: U1_MCU.3 32.92,78.49 34.29,78.49 44.96,89.15 63.7,89.15 63.86,89.31 67.51,89.31 91.14,65.68 91.14,58.22 89.31,56.39 89,56.39 JP1.4
TEST  (via drill 0.35)
  Top 0.152: v43.13,79.1 41.45,79.1 40.23,77.88 38.56,77.88 U1_MCU.25
  Bottom 0.152: v43.13,79.1 44.81,79.1 55.47,89.76 75.13,89.76 87.17,77.72 87.17,55.47 88.85,53.8 JP1.3
TX
  Top 0.152: U1_MCU.4 32.92,77.88 34.59,77.88 45.57,88.85 63.86,88.85 64.01,89 65.23,89 83.06,71.17 83.06,64.62 88.85,58.83 JP1.5

### Text on the board
tPlace: Segwaybot / Author: / Jiaming / Alex